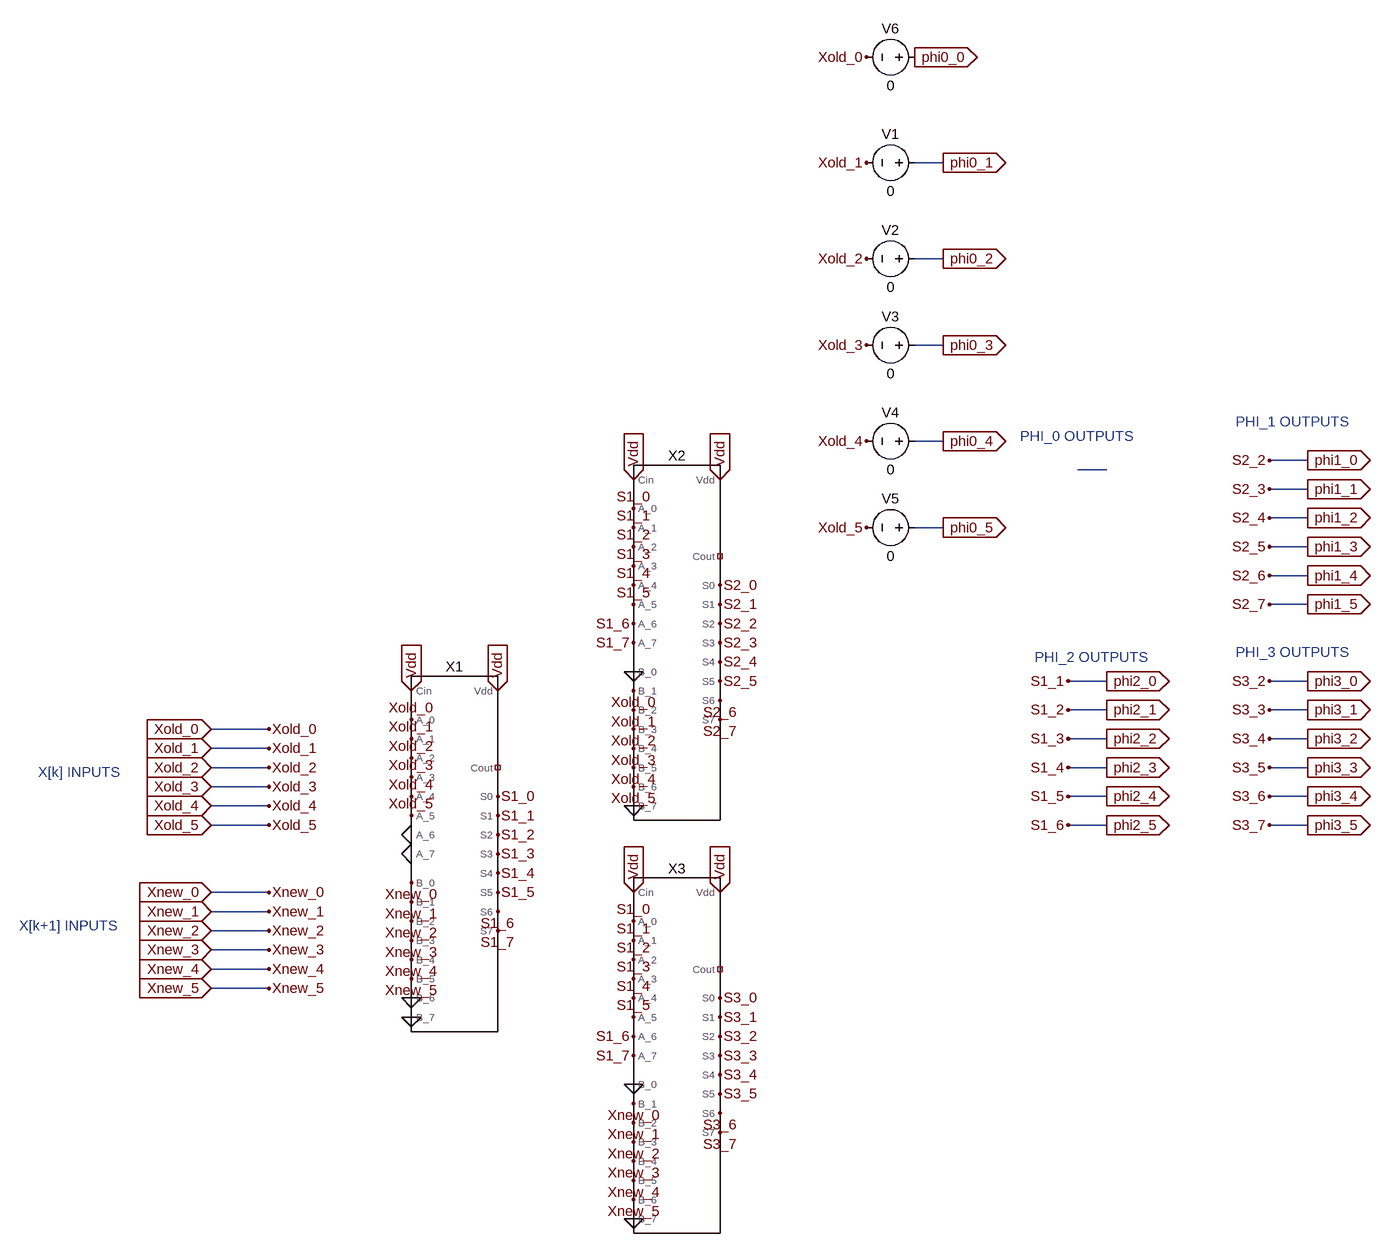
[diagram p0: schematic FIR_CLA.asc]
FIR_CLA.asc, the LTspice schematic file:
Version 4
SHEET 1 3132 1176
WIRE 2208 -1008 2160 -1008
WIRE 2208 -848 2160 -848
WIRE 2208 -704 2160 -704
WIRE 2208 -544 2160 -544
WIRE 2992 -512 2928 -512
WIRE 2480 -496 2432 -496
WIRE 2992 -464 2928 -464
WIRE 2992 -416 2928 -416
WIRE 2208 -400 2160 -400
WIRE 2992 -368 2928 -368
WIRE 2992 -320 2928 -320
WIRE 2992 -272 2928 -272
WIRE 2480 -144 2416 -144
WIRE 2992 -144 2928 -144
WIRE 2480 -96 2416 -96
WIRE 2992 -96 2928 -96
WIRE 32 -64 -64 -64
WIRE 2480 -48 2416 -48
WIRE 2992 -48 2928 -48
WIRE 32 -32 -64 -32
WIRE 32 0 -64 0
WIRE 2480 0 2416 0
WIRE 2992 0 2928 0
WIRE 32 32 -64 32
WIRE 2480 48 2416 48
WIRE 2992 48 2928 48
WIRE 32 64 -64 64
WIRE 32 96 -64 96
WIRE 2480 96 2416 96
WIRE 2992 96 2928 96
WIRE 32 208 -64 208
WIRE 32 240 -64 240
WIRE 32 272 -64 272
WIRE 32 304 -64 304
WIRE 32 336 -64 336
WIRE 32 368 -64 368
FLAG -64 -64 Xold_0
IOPIN -64 -64 In
FLAG -64 -32 Xold_1
IOPIN -64 -32 In
FLAG -64 0 Xold_2
IOPIN -64 0 In
FLAG -64 32 Xold_3
IOPIN -64 32 In
FLAG -64 64 Xold_4
IOPIN -64 64 In
FLAG -64 96 Xold_5
IOPIN -64 96 In
FLAG -64 208 Xnew_0
IOPIN -64 208 In
FLAG -64 240 Xnew_1
IOPIN -64 240 In
FLAG -64 272 Xnew_2
IOPIN -64 272 In
FLAG -64 304 Xnew_3
IOPIN -64 304 In
FLAG -64 336 Xnew_4
IOPIN -64 336 In
FLAG -64 368 Xnew_5
IOPIN -64 368 In
FLAG 912 48 S1_0
FLAG 912 80 S1_1
FLAG 912 112 S1_2
FLAG 912 144 S1_3
FLAG 912 176 S1_4
FLAG 912 208 S1_5
FLAG 912 240 S1_6
FLAG 912 272 S1_7
FLAG 1440 -128 Xold_0
FLAG 1440 -96 Xold_1
FLAG 1440 -64 Xold_2
FLAG 1440 -32 Xold_3
FLAG 1440 0 Xold_4
FLAG 1440 32 Xold_5
FLAG 1440 560 Xnew_0
FLAG 1440 592 Xnew_1
FLAG 1440 624 Xnew_2
FLAG 1440 656 Xnew_3
FLAG 1440 688 Xnew_4
FLAG 1440 720 Xnew_5
FLAG 768 112 0
FLAG 768 144 0
FLAG 768 384 0
FLAG 768 416 0
FLAG 1440 64 0
FLAG 1440 -160 0
FLAG 1440 752 0
FLAG 1440 528 0
FLAG 2160 -1184 phi0_0
IOPIN 2160 -1184 Out
FLAG 2208 -1008 phi0_1
IOPIN 2208 -1008 Out
FLAG 2208 -848 phi0_2
IOPIN 2208 -848 Out
FLAG 2208 -704 phi0_3
IOPIN 2208 -704 Out
FLAG 2208 -544 phi0_4
IOPIN 2208 -544 Out
FLAG 2208 -400 phi0_5
IOPIN 2208 -400 Out
FLAG 2992 -512 phi1_0
IOPIN 2992 -512 Out
FLAG 2992 -464 phi1_1
IOPIN 2992 -464 Out
FLAG 2992 -416 phi1_2
IOPIN 2992 -416 Out
FLAG 2992 -368 phi1_3
IOPIN 2992 -368 Out
FLAG 2992 -320 phi1_4
IOPIN 2992 -320 Out
FLAG 2992 -272 phi1_5
IOPIN 2992 -272 Out
FLAG 2992 -144 phi3_0
IOPIN 2992 -144 Out
FLAG 2992 -96 phi3_1
IOPIN 2992 -96 Out
FLAG 2992 -48 phi3_2
IOPIN 2992 -48 Out
FLAG 2992 0 phi3_3
IOPIN 2992 0 Out
FLAG 2992 48 phi3_4
IOPIN 2992 48 Out
FLAG 2992 96 phi3_5
IOPIN 2992 96 Out
FLAG 2480 -144 phi2_0
IOPIN 2480 -144 Out
FLAG 2480 -96 phi2_1
IOPIN 2480 -96 Out
FLAG 2480 -48 phi2_2
IOPIN 2480 -48 Out
FLAG 2480 0 phi2_3
IOPIN 2480 0 Out
FLAG 2480 48 phi2_4
IOPIN 2480 48 Out
FLAG 2480 96 phi2_5
IOPIN 2480 96 Out
FLAG 2080 -1184 Xold_0
FLAG 2080 -1008 Xold_1
FLAG 2080 -848 Xold_2
FLAG 2080 -704 Xold_3
FLAG 2080 -544 Xold_4
FLAG 2080 -400 Xold_5
FLAG 2416 -144 S1_1
FLAG 2416 -96 S1_2
FLAG 2416 -48 S1_3
FLAG 2416 0 S1_4
FLAG 2416 48 S1_5
FLAG 2416 96 S1_6
FLAG 1584 -304 S2_0
FLAG 1584 -272 S2_1
FLAG 1584 -240 S2_2
FLAG 1584 -208 S2_3
FLAG 1584 -176 S2_4
FLAG 1584 -144 S2_5
FLAG 1584 -112 S2_6
FLAG 1584 -80 S2_7
FLAG 1584 384 S3_0
FLAG 1584 416 S3_1
FLAG 1584 448 S3_2
FLAG 1584 480 S3_3
FLAG 1584 512 S3_4
FLAG 1584 544 S3_5
FLAG 1584 576 S3_6
FLAG 1584 608 S3_7
FLAG 2928 -512 S2_2
FLAG 2928 -464 S2_3
FLAG 2928 -416 S2_4
FLAG 2928 -368 S2_5
FLAG 2928 -320 S2_6
FLAG 2928 -272 S2_7
FLAG 2928 -144 S3_2
FLAG 2928 -96 S3_3
FLAG 2928 -48 S3_4
FLAG 2928 0 S3_5
FLAG 2928 48 S3_6
FLAG 2928 96 S3_7
FLAG 1440 -432 S1_0
FLAG 1440 -400 S1_1
FLAG 1440 -368 S1_2
FLAG 1440 -336 S1_3
FLAG 1440 -304 S1_4
FLAG 1440 -272 S1_5
FLAG 1440 -240 S1_6
FLAG 1440 -208 S1_7
FLAG 1440 256 S1_0
FLAG 1440 288 S1_1
FLAG 1440 320 S1_2
FLAG 1440 352 S1_3
FLAG 1440 384 S1_4
FLAG 1440 416 S1_5
FLAG 1440 448 S1_6
FLAG 1440 480 S1_7
FLAG 768 -128 Vdd
IOPIN 768 -128 In
FLAG 912 -128 Vdd
IOPIN 912 -128 In
FLAG 1440 208 Vdd
IOPIN 1440 208 In
FLAG 1584 208 Vdd
IOPIN 1584 208 In
FLAG 1440 -480 Vdd
IOPIN 1440 -480 In
FLAG 1584 -480 Vdd
IOPIN 1584 -480 In
FLAG 32 -64 Xold_0
FLAG 32 0 Xold_2
FLAG 32 32 Xold_3
FLAG 32 64 Xold_4
FLAG 32 96 Xold_5
FLAG 32 208 Xnew_0
FLAG 32 240 Xnew_1
FLAG 32 272 Xnew_2
FLAG 32 304 Xnew_3
FLAG 32 336 Xnew_4
FLAG 32 368 Xnew_5
FLAG 32 -32 Xold_1
FLAG 768 -80 Xold_0
FLAG 768 -16 Xold_2
FLAG 768 16 Xold_3
FLAG 768 48 Xold_4
FLAG 768 80 Xold_5
FLAG 768 -48 Xold_1
FLAG 768 192 Xnew_0
FLAG 768 224 Xnew_1
FLAG 768 256 Xnew_2
FLAG 768 288 Xnew_3
FLAG 768 320 Xnew_4
FLAG 768 352 Xnew_5
SYMBOL CLA-8bit 832 144 R0
SYMATTR InstName X1
SYMBOL CLA-8bit 1504 -208 R0
SYMATTR InstName X2
SYMBOL CLA-8bit 1504 480 R0
SYMATTR InstName X3
SYMBOL voltage 2176 -1008 R90
WINDOW 0 -32 56 VBottom 2
WINDOW 3 32 56 VTop 2
WINDOW 123 0 0 Left 0
WINDOW 39 0 0 Left 0
SYMATTR InstName V1
SYMATTR Value 0
SYMBOL voltage 2176 -848 R90
WINDOW 0 -32 56 VBottom 2
WINDOW 3 32 56 VTop 2
WINDOW 123 0 0 Left 0
WINDOW 39 0 0 Left 0
SYMATTR InstName V2
SYMATTR Value 0
SYMBOL voltage 2176 -704 R90
WINDOW 0 -32 56 VBottom 2
WINDOW 3 32 56 VTop 2
WINDOW 123 0 0 Left 0
WINDOW 39 0 0 Left 0
SYMATTR InstName V3
SYMATTR Value 0
SYMBOL voltage 2176 -544 R90
WINDOW 0 -32 56 VBottom 2
WINDOW 3 32 56 VTop 2
WINDOW 123 0 0 Left 0
WINDOW 39 0 0 Left 0
SYMATTR InstName V4
SYMATTR Value 0
SYMBOL voltage 2176 -400 R90
WINDOW 0 -32 56 VBottom 2
WINDOW 3 32 56 VTop 2
WINDOW 123 0 0 Left 0
WINDOW 39 0 0 Left 0
SYMATTR InstName V5
SYMATTR Value 0
SYMBOL voltage 2176 -1184 R90
WINDOW 0 -32 56 VBottom 2
WINDOW 3 32 56 VTop 2
WINDOW 123 0 0 Left 0
WINDOW 39 0 0 Left 0
SYMATTR InstName V6
SYMATTR Value 0
TEXT 2336 -552 Left 2 ;PHI_0 OUTPUTS
TEXT 2872 -576 Left 2 ;PHI_1 OUTPUTS
TEXT 2872 -192 Left 2 ;PHI_3 OUTPUTS
TEXT 2360 -184 Left 2 ;PHI_2 OUTPUTS
TEXT -352 8 Left 2 ;X[k] INPUTS
TEXT -384 264 Left 2 ;X[k+1] INPUTS

The netlist it stands for:
* FIR_CLA.asc
XX1 Xold_0 Xold_1 Xold_2 Xold_3 Xold_4 Xold_5 0 0 Xnew_0 Xnew_1 Xnew_2 Xnew_3 Xnew_4 Xnew_5 0 0 Vdd Vdd NC_01 S1_0 phi2_0 phi2_1 phi2_2 phi2_3 phi2_4 phi2_5 S1_7 CLA-8bit  ; pins A_0 A_1 A_2 A_3 A_4 A_5 A_6 A_7 B_0 B_1 B_2 B_3 B_4 B_5 B_6 B_7 Cin Vdd Cout S0 S1 S2 S3 S4 S5 S6 S7
XX2 S1_0 phi2_0 phi2_1 phi2_2 phi2_3 phi2_4 phi2_5 S1_7 0 Xold_0 Xold_1 Xold_2 Xold_3 Xold_4 Xold_5 0 Vdd Vdd NC_02 S2_0 S2_1 S2_2 S2_3 S2_4 S2_5 S2_6 S2_7 CLA-8bit  ; pins A_0 A_1 A_2 A_3 A_4 A_5 A_6 A_7 B_0 B_1 B_2 B_3 B_4 B_5 B_6 B_7 Cin Vdd Cout S0 S1 S2 S3 S4 S5 S6 S7
XX3 S1_0 phi2_0 phi2_1 phi2_2 phi2_3 phi2_4 phi2_5 S1_7 0 Xnew_0 Xnew_1 Xnew_2 Xnew_3 Xnew_4 Xnew_5 0 Vdd Vdd NC_03 S3_0 S3_1 S3_2 S3_3 S3_4 S3_5 S3_6 S3_7 CLA-8bit  ; pins A_0 A_1 A_2 A_3 A_4 A_5 A_6 A_7 B_0 B_1 B_2 B_3 B_4 B_5 B_6 B_7 Cin Vdd Cout S0 S1 S2 S3 S4 S5 S6 S7
V1 phi0_1 Xold_1 0
V2 phi0_2 Xold_2 0
V3 phi0_3 Xold_3 0
V4 phi0_4 Xold_4 0
V5 phi0_5 Xold_5 0
V6 phi0_0 Xold_0 0
* PHI_0 OUTPUTS
* PHI_1 OUTPUTS
* PHI_3 OUTPUTS
* PHI_2 OUTPUTS
* X[k] INPUTS
* X[k+1] INPUTS
.backanno
.end